# Altium schematic sheet Power1.SchDoc
size A4
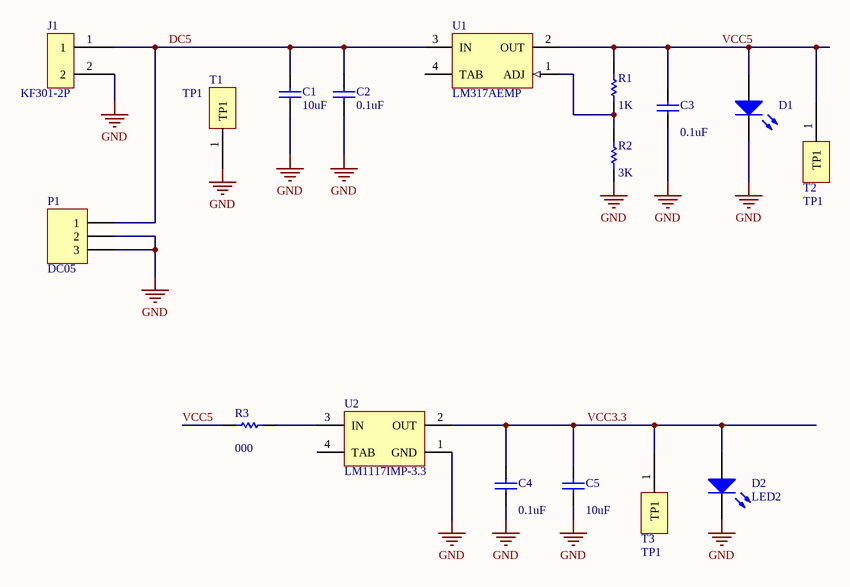
[diagram p0: Power1.SchDoc]

## Parts
C1  value 10uF  [CAPC3216L]  (hidden comment: Cap Semi)
C2  value 0.1uF  [CAPC3216L]  (hidden comment: Cap Semi)
C3  value 0.1uF  [CAPC3216L]  (hidden comment: Cap Semi)
C4  value 0.1uF  [CAPC3216L]  (hidden comment: Cap Semi)
C5  value 10uF  [CAPC3216L]  (hidden comment: Cap Semi)
D1  LED0  [CAPC2512L]  (value not drawn)
D2  LED2  [CAPC2512L]
J1  KF301-2P  [KF301-2P]
P1  DC05  [DC005]
R1  value 1K  [RESC3216L]  (hidden comment: Res Semi)
R2  value 3K  [RESC3216L]  (hidden comment: Res Semi)
R3  value 000  [RESC3216L]  (hidden comment: Res Semi)
T1  TP1  [TP1]
T2  TP1  [TP1]
T3  TP1  [TP1]
U1  LM317AEMP  [MP04A_L]
U2  LM1117IMP-3.3  [MP04A_N]

## Nets
GND: C1.1 C2.1 C3.1 C4.1 C5.1 D1.2(K) D2.2(K) J1.2 P1.2 P1.3 R2.1 T1.1(TP1) U2.1(GND)
DC5: C1.2 C2.2 J1.1 P1.1 U1.3(IN)
VCC3.3: C4.2 C5.2 D2.1(A) T3.1(TP1) U2.2(OUT)
VCC5: C3.2 D1.1(A) R1.2 R3.1 T2.1(TP1) U1.2(OUT)
NetR1_1: R1.1 R2.2 U1.1(ADJ)
NetR3_2: R3.2 U2.3(IN)

Not connected (* = marked no-connect by the designer): U1 4(TAB); U2 4(TAB)

## Library data of the parts
C1-C5 = Cap Semi: Capacitor (Semiconductor SIM Model); Published: 8-Jun-2000; LatestRevisionDate: 29-May-2009; LatestRevisionNote: IPC-7351 Footprint Added.; PackageReference: C1206; Publisher: Altium Limited; PackageDescription: Chip Capacitor
D1 = LED0: Typical INFRARED GaAs LED; Published: 8-Jun-2000; LatestRevisionDate: 08-Jul-2005; LatestRevisionNote: Mech Layer 1 removed.; PackageReference: LED-0; Publisher: Altium Limited
D2 = LED2: Typical RED, GREEN, YELLOW, AMBER GaAs LED; Published: 8-Jun-2000; LatestRevisionDate: 17-Jul-2002; LatestRevisionNote: Re-released for DXP Platform.; PackageVersion: Feb-2002; PackageReference: 3.2X1.6X1.1; Publisher: Altium Limited
P1 = Header 3: Header, 3-Pin; LatestRevisionDate: 17-Jul-2002; LatestRevisionNote: Re-released for DXP Platform.; Publisher: Altium Limited
R1-R3 = Res Semi: Semiconductor Resistor; Published: 8-Jun-2000; LatestRevisionDate: 17-Jul-2002; LatestRevisionNote: Re-released for DXP Platform.; PackageReference: AXIAL-0.5; Publisher: Altium Limited
U1 = LM317AEMP: 3-Terminal Adjustable Regulator; Manufacturer: National Semiconductor; CompType: LDO IC; PackageTopMarking: XYTT*N07A; PowerWise: N; Published: 4-Dec-2008; DatasheetVersion: Apr-2007; PackageVersion: revB, Apr-2003; PackageReference: MP04A; Publisher: Altium Limited; PackageDescription: Molded SOT-223, 6.50 x 3.56 x 1.6mm Body, 4 Lead, 2.3mm Pitch; PartNumber: LM317AEMP; RoHS: O; PinCount: 4; DigiKeyPartNumber: LM317AEMPCT-ND; Code_JEDEC: TO-261-AA; Code_IPC: SOT223-4; ComponentLink1Description: LM317 Datasheet; ComponentLink1URL: http://www.national.com/ds/LM/LM317.pdf; ComponentLink2Description: LM317 Web Page; ComponentLink2URL: http://www.national.com/pf/LM/LM317.html; ComponentLink3Description: MP04A Package Page; ComponentLink3URL: http://www.national.com/packaging/folders/mp04a.html
U2 = LM1117IMP-3.3: 800mA Low-Dropout Linear Regulator; Manufacturer: National Semiconductor; CompType: LDO IC; PackageTopMarking: XYTT*N05B; PowerWise: N; Published: 4-Dec-2008; DatasheetVersion: Apr-2006; PackageVersion: revB, Apr-2003; PackageReference: MP04A; Publisher: Altium Limited; PackageDescription: Molded SOT-223, 6.50 x 3.56 x 1.6mm Body, 4 Lead, 2.3mm Pitch; PartNumber: LM1117IMP-3.3; RoHS: O; PinCount: 4; DigiKeyPartNumber: LM1117IMP-3.3CT-ND; Code_JEDEC: TO-261-AA; Code_IPC: SOT223-4; ComponentLink1Description: LM1117 Datasheet; ComponentLink1URL: http://www.national.com/ds/LM/LM1117.pdf; ComponentLink2Description: LM1117 Web Page; ComponentLink2URL: http://www.national.com/pf/LM/LM1117.html; ComponentLink3Description: MP04A Package Page; ComponentLink3URL: http://www.national.com/packaging/folders/mp04a.html